# Altium schematic sheet Main Pyro.SchDoc
size A4; SheetNumber: 4; SheetTotal: 7
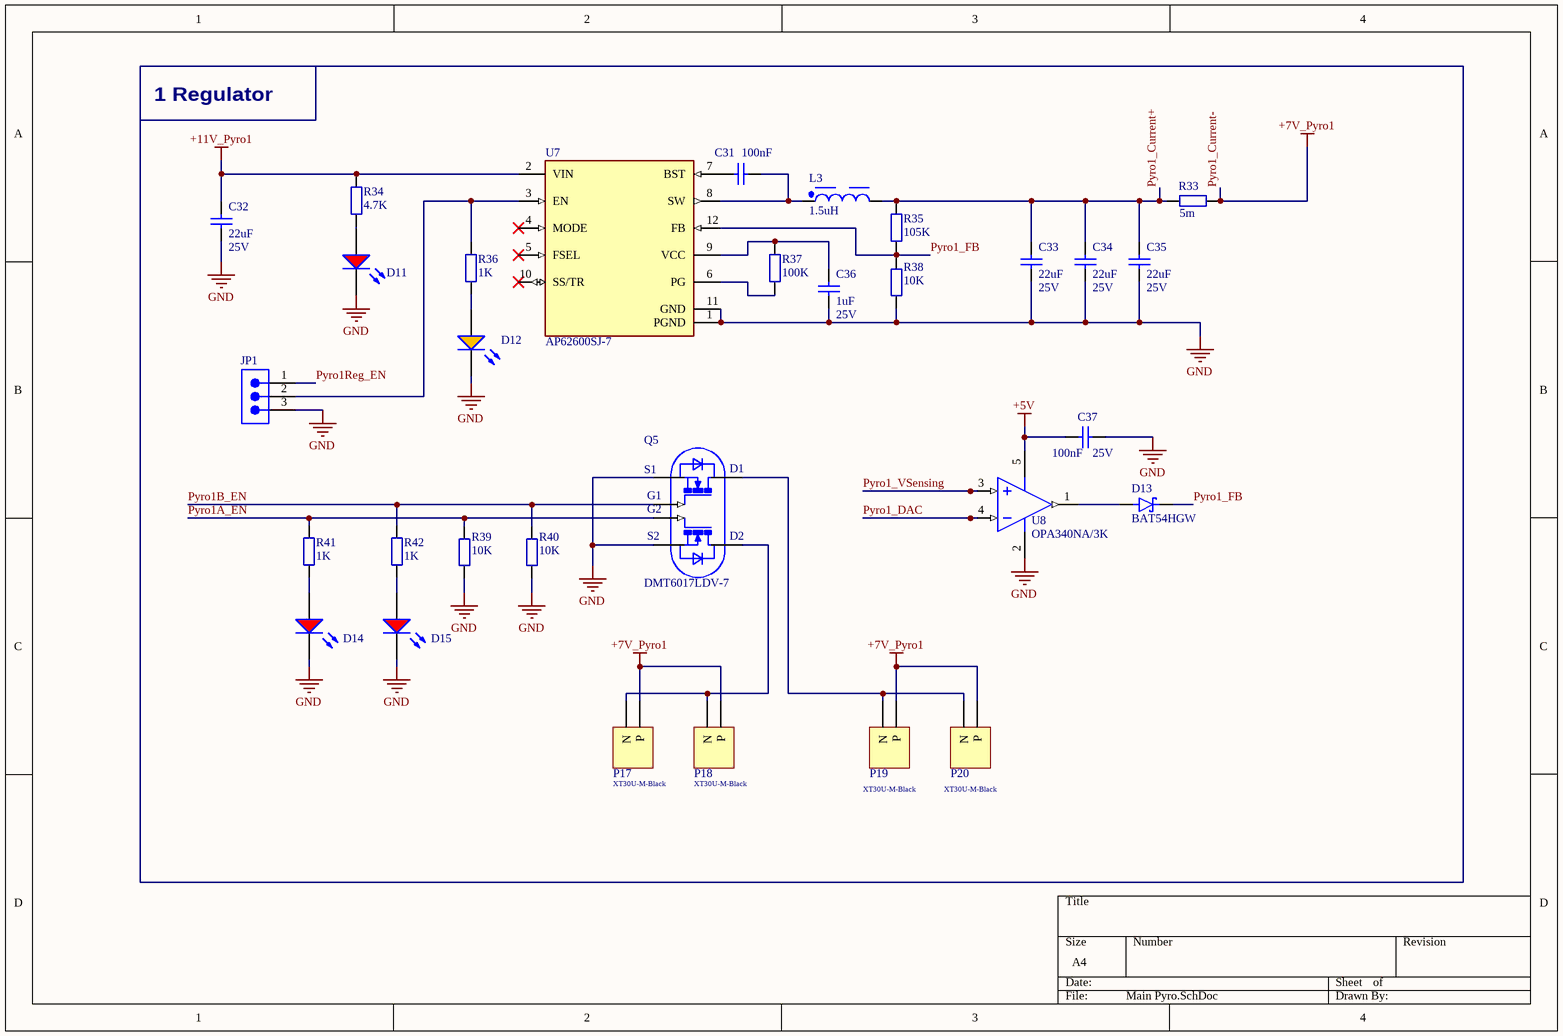
[diagram p0: Main Pyro.SchDoc]

## Parts
C31  value 100nF  [MY_0603]  (hidden comment: Cap ceramic)
C32  22uF  Voltage: 25V  [MY_0805]
C33  22uF  Voltage: 25V  [MY_0805]
C34  22uF  Voltage: 25V  [MY_0805]
C35  22uF  Voltage: 25V  [MY_0805]
C36  value 1uF  Volte: 25V  [MY_0603]  (hidden comment: Cap ceramic)
C37  value 100nF  Voltage: 25V  [MY_0603]  (hidden comment: Cap ceramic)
D11  150080RS75000  [WL-SMCW_0805_150080xx75000]  (value not drawn)
D12  150080AS75000  [WL-SMCW_0805_150080xx75000]  (value not drawn)
D13  BAT54HGW  [BAT54HGW-Footprint-1]
D14  150080RS75000  [WL-SMCW_0805_150080xx75000]  (value not drawn)
D15  150080RS75000  [WL-SMCW_0805_150080xx75000]  (value not drawn)
JP1  Jumper 3 pin, 2,54mm  [Jumper 3 pin, 2,54mm-Footprint-1]  (value not drawn)
L3  1.5uH  [WE-MAPI_4020]
P17  XT30U-M-Black  [XT30-Footprint-2]
P18  XT30U-M-Black  [XT30-Footprint-2]
P19  XT30U-M-Black  [XT30-Footprint-2]
P20  XT30U-M-Black  [XT30-Footprint-2]
Q5  DMT6017LDV-7  [DMT6017LDV-7-Footprint-1]
R33  5m  [R0612]
R34  4.7K  [R0603-0.45]
R35  105K  [R0603-0.45]
R36  1K  [R0603-0.45]
R37  100K  [R0603-0.45]
R38  10K  [R0603-0.45]
R39  10K  [R0603-0.45]
R40  10K  [R0603-0.45]
R41  1K  [R0603-0.45]
R42  1K  [R0603-0.45]
U7  AP62600SJ-7  [FP-V-QFN2030-12_Type_A-MFG]
U8  OPA340NA/3K  [DBV0005A_M]

## Blocks framed on the sheet
1 Regulator: C31-C37 D11-D15 JP1 L3 P17-P20 Q5 R33-R42 U7 U8

## Nets
+5V: C37.2 U8.5(V+)
+11V_Pyro1: C32.1 R34.2 U7.2(VIN)
GND: C32.2 C33.2 C34.2 C35.2 C36.1 C37.1 D11.1(K) D12.1(K) D14.1(K) D15.1(K) JP1.3 Q5.1(S1) Q5.3(S2) R38.2 R39.2 R40.2 U7.1(PGND) U7.11(GND) U8.2(V-)
Pyro1_Current-: P17.P P18.P P19.P P20.P R33.2  [also labelled +7V_Pyro1]
Pyro1_Current+: C33.1 C34.1 C35.1 L3.2 R33.1 R35.1
Pyro1_DAC: U8.4(IN-)
Pyro1_FB: D13.C(K) R35.2 R38.1 U7.12(FB)
Pyro1_VSensing: U8.3(IN+)
Pyro1A_EN: Q5.4(G2) R39.1 R41.2
Pyro1B_EN: Q5.2(G1) R40.1 R42.2
Pyro1Reg_EN: JP1.1
NetC31_1: C31.1 L3.1 U7.8(SW)
NetC31_2: C31.2 U7.7(BST)
NetC36_2: C36.2 R37.1 U7.9(VCC)
NetD11_2: D11.2(A) R34.1
NetD12_2: D12.2(A) R36.1
NetD13_A: D13.A U8.1(OUT)
NetD14_2: D14.2(A) R41.1
NetD15_2: D15.2(A) R42.1
NetJP1_2: JP1.2 R36.2 U7.3(EN)
NetP17_N: P17.N P18.N Q5.6(D2)
NetP19_N: P19.N P20.N Q5.8(D1)
NetR37_2: R37.2 U7.6(PG)

Not connected (* = marked no-connect by the designer): U7 4(MODE)* 5(FSEL)* 10(SS/TR)*

## Library data of the parts
C31 C37 = CMP-015-000000-1: Capacitor, 100nF, 0603, 25V; Manufacturer: Wurth Elektronik; Manufacturer Part Number: 885012206071
  C31: Voltage: 25V; ClassName: 1PyroREG
  C37: ClassName: 1Pyro OPAMP
C32-C35 = CMP-015-000000-1: Capacitor, 22uF, 0805, 25V; Manufacturer: Samsung; Manufacturer Part Number: CL21A226MAYNNNE; ClassName: REG5V
C36 = CMP-015-000000-1: Capacitor, 1uF, 0603, 25V; Manufacturer: Wurth Elektronik; Manufacturer Part Number: 885012206052; ClassName: 1PyroREG
D11 = CMP-1426-00011-2: LED, 0805, Red; NexarPartId: 29717781; Manufacturer: Wurth Elektronik; Peak Wavelength: 630nm; Wavelength: 625nm; Viewing Angle: 140°; Test Current: 20mA; Forward Voltage: 2V; Forward Current: 100mA; Lens Style: Clear, Rectangular; Luminous Intensity: 150mcd; Max Reverse Voltage (DC): 5V; Length: 2mm; Case Code (Imperial): 0805; RoHS: Compliant; Max Operating Temperature: 85°C; Height: 700µm; Packaging: Tape and Reel; Color: Red; Case/Package: 0805; REACH SVHC: Unknown; Dominant Wavelength: 625nm; Min Operating Temperature: -40°C; Case Code (Metric): 2012; Mount: Surface Mount; Width: 1.25mm; Manufacturer Part Number: 150080RS75000
D12 = CMP-03913-89970695-1: LED, 0805, Amber; Manufacturer: Wurth Elektronik; Manufacturer Part Number: 150080AS75000
D13 = CMP-100-000001-3: BAT54HGW Schotty Diode; Manufacturer: Nexperia; Manufacturer Part Number: BAT54HGW
D14 D15 = CMP-1426-00011-2: NexarPartId: 29717781; Manufacturer: Wurth Elektronik; Peak Wavelength: 630nm; Wavelength: 625nm; Viewing Angle: 140°; Test Current: 20mA; Forward Voltage: 2V; Forward Current: 100mA; Lens Style: Clear, Rectangular; Color: Red; Luminous Intensity: 150mcd; Max Reverse Voltage (DC): 5V; Length: 2mm; Case Code (Imperial): 0805; RoHS: Compliant; Max Operating Temperature: 85°C; Height: 700µm; Packaging: Tape and Reel; Case/Package: 0805; REACH SVHC: Unknown; Dominant Wavelength: 625nm; Min Operating Temperature: -40°C; Case Code (Metric): 2012; Mount: Surface Mount; Width: 1.25mm; Manufacturer Part Number: 150080RS75000
JP1 = CMP-002-00265-1
L3 = CMP-03913-66963831-2: 74438356015 Fixed Ind 1.5UH 5.8A 19 Mohm SMD; Manufacturer: Wurth Elektronik; Manufacturer Part Number: 74438356015; ClassName: 1PyroREG
P17-P20 = CMP-002-00004-11: XT30PW-M公头 Socket,DCsupply,XT30,male,PIN:2; Manufacturer: AMASS; Manufacturer Part Number: XT30U-M-Black
Q5 = CMP-013-00011-1: Small Signal Field-Effect Transistor; RoHS Compliant: Yes
R33 = CMP-009-000000-6: Resistor, 5m, 0612, 2W; Manufacturer: Vishay; Manufacturer Part Number: WFCP06125L000FE66; ClassName: 1Pyro OPAMP
R34 = CMP-009-000000-3: Resistor, 4.7K, 0603, 0.1W; Manufacturer: Wurth; Manufacturer Part Number: 560112116006; Power Disipation: 0.1W
R35 = R: Resistor, 105K, 0603, 0.1W; Manufacturer: Wurth; Manufacturer Part Number: 560112110183; Power Disipation: 0.1W; ClassName: 1PyroREG
R36 R41 R42 = CMP-009-000000-3: Resistor, 1K, 0603, 0.1W; Manufacturer: Wurth; Manufacturer Part Number: 560112116014; Power Disipation: 0.1W
R37 = R: Resistor, 100K, 0603, 0.1W; Manufacturer: Wurth; Manufacturer Part Number: 560112116004; Power Disipation: 0.1W; ClassName: REG5V
R38-R40 = R: Resistor, 10K, 0603, 0.1W; Manufacturer: Vishay; Manufacturer Part Number: RCS060310K0FKEA; Power Disipation: 0.25W
  R38 R39: ClassName: 1PyroREG
  R40: ClassName: MainPyroREG
U7 = CMP-012-00004-1: Switching Regulator, 1200kHz Switching Freq-Max; Manufacturer: Diodes Incorporated; Manufacturer Part Number: AP62600SJ-7; ClassName: 1PyroREG
U8 = CMP-0272-00929-3: Single-Supply, Rail-to-Rail Operational Amplifier MicroAmplifier(TM) Series, 2.7 to 5.5 V, -40 to 85 degC, 5-pin SOT23 (DBV5), Green (RoHS & no Sb/Br); Manufacturer: Texas Instruments; ComponentLink3URL: http://www.ti.com/litv/pdf/mpds018i; ComponentLink1Description: Manufacturer URL; ComponentLink1URL: http://www.ti.com/; ComponentLink3Description: Package Specification; ComponentLink2URL: http://www.ti.com/general/docs/lit/getliterature.tsp?genericPartNumber=OPA340&fileType=pdf; ComponentLink2Description: Datasheet; Manufacturer Part Number: OPA340NA/3K